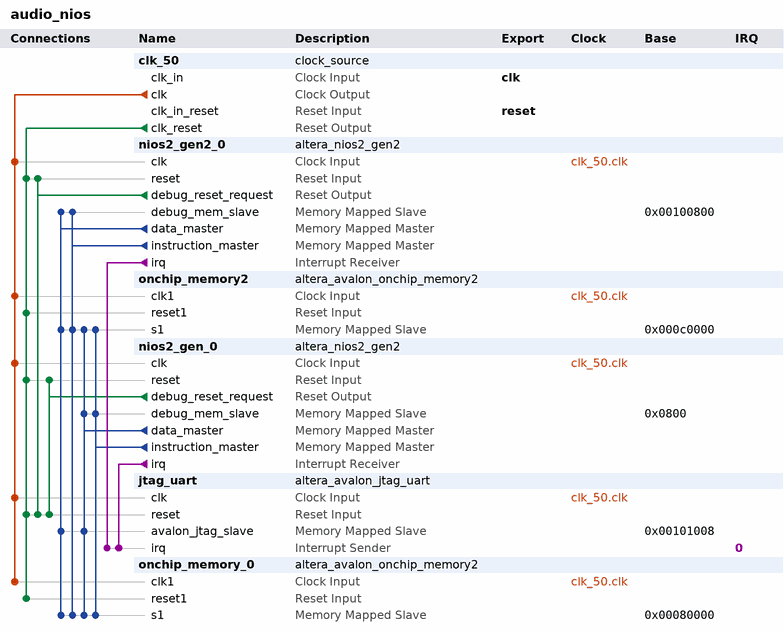
[diagram p0: system contents]
# Platform Designer (Qsys) system audio_nios, Cyclone V 5CSXFC6D6F31C6
# Parameters at their usual value, and those the tool derives, are not listed.
package require -exact qsys 18.1
create_system audio_nios
set_project_property DEVICE_FAMILY {Cyclone V}
set_project_property DEVICE 5CSXFC6D6F31C6

add_instance clk_50 clock_source 18.1
set_instance_parameter_value clk_50 clockFrequency 50000000

add_instance nios2_gen2_0 altera_nios2_gen2 18.1
set_instance_parameter_value nios2_gen2_0 dcache_size 2048
set_instance_parameter_value nios2_gen2_0 exceptionSlave onchip_memory2.s1
set_instance_parameter_value nios2_gen2_0 icache_size 4096
set_instance_parameter_value nios2_gen2_0 impl Fast
set_instance_parameter_value nios2_gen2_0 resetSlave onchip_memory2.s1

add_instance onchip_memory2 altera_avalon_onchip_memory2 18.1
set_instance_parameter_value onchip_memory2 dataWidth 32
set_instance_parameter_value onchip_memory2 dualPort false
set_instance_parameter_value onchip_memory2 initMemContent true
set_instance_parameter_value onchip_memory2 initializationFileName onchip_mem.hex
set_instance_parameter_value onchip_memory2 memorySize 160000

add_instance nios2_gen_0 altera_nios2_gen2 18.1
set_instance_parameter_value nios2_gen_0 dcache_size 2048
set_instance_parameter_value nios2_gen_0 exceptionSlave onchip_memory2.s1
set_instance_parameter_value nios2_gen_0 icache_size 4096
set_instance_parameter_value nios2_gen_0 impl Fast
set_instance_parameter_value nios2_gen_0 resetSlave onchip_memory2.s1

add_instance jtag_uart altera_avalon_jtag_uart 18.1
set_instance_parameter_value jtag_uart simInteractiveOptions INTERACTIVE_ASCII_OUTPUT

add_instance onchip_memory_0 altera_avalon_onchip_memory2 18.1
set_instance_parameter_value onchip_memory_0 dataWidth 32
set_instance_parameter_value onchip_memory_0 dualPort false
set_instance_parameter_value onchip_memory_0 initMemContent true
set_instance_parameter_value onchip_memory_0 initializationFileName onchip_mem.hex
set_instance_parameter_value onchip_memory_0 memorySize 160000

# connections
add_connection clk_50.clk jtag_uart.clk clock
add_connection clk_50.clk nios2_gen2_0.clk clock
add_connection clk_50.clk nios2_gen_0.clk clock
add_connection clk_50.clk onchip_memory2.clk1 clock
add_connection clk_50.clk onchip_memory_0.clk1 clock
add_connection clk_50.clk_reset jtag_uart.reset reset
add_connection clk_50.clk_reset nios2_gen2_0.reset reset
add_connection clk_50.clk_reset nios2_gen_0.reset reset
add_connection clk_50.clk_reset onchip_memory2.reset1 reset
add_connection clk_50.clk_reset onchip_memory_0.reset1 reset
add_connection nios2_gen2_0.debug_reset_request jtag_uart.reset reset
add_connection nios2_gen2_0.debug_reset_request nios2_gen2_0.reset reset
add_connection nios2_gen_0.debug_reset_request jtag_uart.reset reset
add_connection nios2_gen_0.debug_reset_request nios2_gen_0.reset reset
add_connection nios2_gen2_0.data_master jtag_uart.avalon_jtag_slave avalon
set_connection_parameter_value nios2_gen2_0.data_master/jtag_uart.avalon_jtag_slave baseAddress 0x00101008
add_connection nios2_gen2_0.data_master nios2_gen2_0.debug_mem_slave avalon
set_connection_parameter_value nios2_gen2_0.data_master/nios2_gen2_0.debug_mem_slave baseAddress 0x00100800
add_connection nios2_gen2_0.data_master onchip_memory2.s1 avalon
set_connection_parameter_value nios2_gen2_0.data_master/onchip_memory2.s1 baseAddress 0x000c0000
add_connection nios2_gen2_0.data_master onchip_memory_0.s1 avalon
set_connection_parameter_value nios2_gen2_0.data_master/onchip_memory_0.s1 baseAddress 0x00080000
add_connection nios2_gen2_0.instruction_master nios2_gen2_0.debug_mem_slave avalon
set_connection_parameter_value nios2_gen2_0.instruction_master/nios2_gen2_0.debug_mem_slave baseAddress 0x00100800
add_connection nios2_gen2_0.instruction_master onchip_memory2.s1 avalon
set_connection_parameter_value nios2_gen2_0.instruction_master/onchip_memory2.s1 baseAddress 0x000c0000
add_connection nios2_gen2_0.instruction_master onchip_memory_0.s1 avalon
set_connection_parameter_value nios2_gen2_0.instruction_master/onchip_memory_0.s1 baseAddress 0x00080000
add_connection nios2_gen_0.data_master jtag_uart.avalon_jtag_slave avalon
set_connection_parameter_value nios2_gen_0.data_master/jtag_uart.avalon_jtag_slave baseAddress 0x00101008
add_connection nios2_gen_0.data_master nios2_gen_0.debug_mem_slave avalon
set_connection_parameter_value nios2_gen_0.data_master/nios2_gen_0.debug_mem_slave baseAddress 0x0800
add_connection nios2_gen_0.data_master onchip_memory2.s1 avalon
set_connection_parameter_value nios2_gen_0.data_master/onchip_memory2.s1 baseAddress 0x000c0000
add_connection nios2_gen_0.data_master onchip_memory_0.s1 avalon
set_connection_parameter_value nios2_gen_0.data_master/onchip_memory_0.s1 baseAddress 0x00080000
add_connection nios2_gen_0.instruction_master nios2_gen_0.debug_mem_slave avalon
set_connection_parameter_value nios2_gen_0.instruction_master/nios2_gen_0.debug_mem_slave baseAddress 0x0800
add_connection nios2_gen_0.instruction_master onchip_memory2.s1 avalon
set_connection_parameter_value nios2_gen_0.instruction_master/onchip_memory2.s1 baseAddress 0x000c0000
add_connection nios2_gen_0.instruction_master onchip_memory_0.s1 avalon
set_connection_parameter_value nios2_gen_0.instruction_master/onchip_memory_0.s1 baseAddress 0x00080000
add_connection nios2_gen2_0.irq jtag_uart.irq interrupt
set_connection_parameter_value nios2_gen2_0.irq/jtag_uart.irq irqNumber 0
add_connection nios2_gen_0.irq jtag_uart.irq interrupt
set_connection_parameter_value nios2_gen_0.irq/jtag_uart.irq irqNumber 0

# exported interfaces
add_interface clk clock sink
set_interface_property clk EXPORT_OF clk_50.clk_in
add_interface reset reset sink
set_interface_property reset EXPORT_OF clk_50.clk_in_reset

set_interconnect_requirement {$system} qsys_mm.clockCrossingAdapter HANDSHAKE
set_interconnect_requirement {$system} qsys_mm.maxAdditionalLatency 0

save_system audio_nios.qsys
